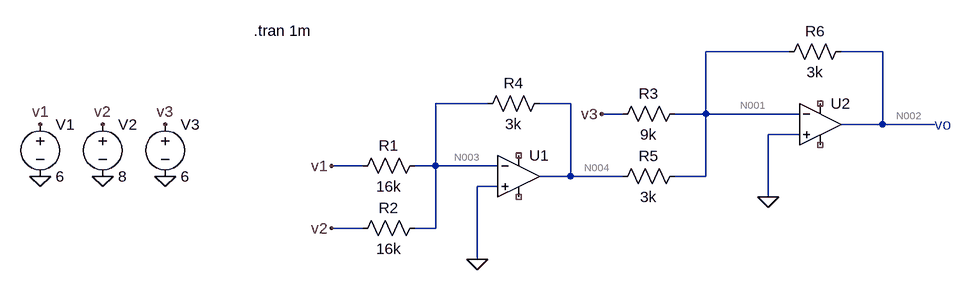
[diagram p0: schematic Q1 a1.asc]
Q1 a1.asc, the LTspice schematic file:
Version 4.1
SHEET 1 896 680
WIRE 640 -64 512 -64
WIRE 784 -64 720 -64
WIRE 176 16 96 16
WIRE 304 16 256 16
WIRE 384 32 352 32
WIRE 512 32 512 -64
WIRE 512 32 464 32
WIRE 656 32 512 32
WIRE 784 48 784 -64
WIRE 784 48 720 48
WIRE 864 48 784 48
WIRE 656 64 608 64
WIRE -16 112 -64 112
WIRE 96 112 96 16
WIRE 96 112 64 112
WIRE 192 112 96 112
WIRE 304 128 304 16
WIRE 304 128 256 128
WIRE 384 128 304 128
WIRE 512 128 512 32
WIRE 512 128 464 128
WIRE 192 144 160 144
WIRE 608 160 608 64
WIRE -16 208 -64 208
WIRE 96 208 96 112
WIRE 96 208 64 208
WIRE 160 256 160 144
FLAG -320 128 0
FLAG -416 128 0
FLAG -512 128 0
FLAG -512 48 v1
FLAG -64 112 v1
FLAG -416 48 v2
FLAG -64 208 v2
FLAG -320 48 v3
FLAG 352 32 v3
FLAG 160 256 0
FLAG 608 160 0
SYMBOL res 80 96 R90
WINDOW 0 0 56 VBottom 2
WINDOW 3 32 56 VTop 2
SYMATTR InstName R1
SYMATTR Value 16k
SYMBOL res 80 192 R90
WINDOW 0 0 56 VBottom 2
WINDOW 3 32 56 VTop 2
SYMATTR InstName R2
SYMATTR Value 16k
SYMBOL res 480 16 R90
WINDOW 0 0 56 VBottom 2
WINDOW 3 32 56 VTop 2
SYMATTR InstName R3
SYMATTR Value 9k
SYMBOL res 272 0 R90
WINDOW 0 0 56 VBottom 2
WINDOW 3 32 56 VTop 2
SYMATTR InstName R4
SYMATTR Value 3k
SYMBOL res 480 112 R90
WINDOW 0 0 56 VBottom 2
WINDOW 3 32 56 VTop 2
SYMATTR InstName R5
SYMATTR Value 3k
SYMBOL res 736 -80 R90
WINDOW 0 0 56 VBottom 2
WINDOW 3 32 56 VTop 2
SYMATTR InstName R6
SYMATTR Value 3k
SYMBOL OpAmps\\UniversalOpAmp1 224 128 R0
SYMATTR InstName U1
SYMATTR Value2 Avol=1000000G GBW=1000000G Vos=0
SYMBOL OpAmps\\UniversalOpAmp1 688 48 R0
SYMATTR InstName U2
SYMATTR Value2 Avol=1000000G GBW=1000000G Vos=0
SYMBOL voltage -512 32 R0
WINDOW 123 0 0 Left 0
WINDOW 39 0 0 Left 0
SYMATTR InstName V1
SYMATTR Value 6
SYMBOL voltage -416 32 R0
WINDOW 123 0 0 Left 0
WINDOW 39 0 0 Left 0
SYMATTR InstName V2
SYMATTR Value 8
SYMBOL voltage -320 32 R0
WINDOW 123 0 0 Left 0
WINDOW 39 0 0 Left 0
SYMATTR InstName V3
SYMATTR Value 6
TEXT 864 48 Left 2 ;vo
TEXT -184 -96 Left 2 !.tran 1m

The netlist it stands for:
* Q1 a1.asc
R1 N003 v1 16k
R2 N003 v2 16k
R3 N001 v3 9k
R4 N004 N003 3k
R5 N001 N004 3k
R6 N002 N001 3k
X§U1 0 N003 NC_01 NC_02 N004 level1 Avol=1000000G GBW=1000000G Vos=0 En=0 Enk=0 In=0 Ink=0 Rin=500Meg  ; pins In+ In- V+ V- OUT
X§U2 0 N001 NC_03 NC_04 N002 level1 Avol=1000000G GBW=1000000G Vos=0 En=0 Enk=0 In=0 Ink=0 Rin=500Meg  ; pins In+ In- V+ V- OUT
V1 v1 0 6
V2 v2 0 8
V3 v3 0 6
* vo
.tran 1m
.lib UniversalOpAmp1.lib
.backanno
.end

* Results of the author's LTspice run, read from the files saved beside the schematic
* Operating Point, zero values left out:
*   V(n002) = 625 mV
*   V(n004) = -2.625 V
*   V(v1) = 6 V
*   V(v2) = 8 V
*   V(v3) = 6 V
*   I(R1) = -375 µA
*   I(R2) = -500 µA
*   I(R3) = -666.7 µA
*   I(R4) = -875 µA
*   I(R5) = 875 µA
*   I(R6) = 208.3 µA
*   I(V1) = -375 µA
*   I(V2) = -500 µA
*   I(V3) = -666.7 µA
*   Ix(u1:5) = -250 mA
*   Ix(u2:5) = 250 mA
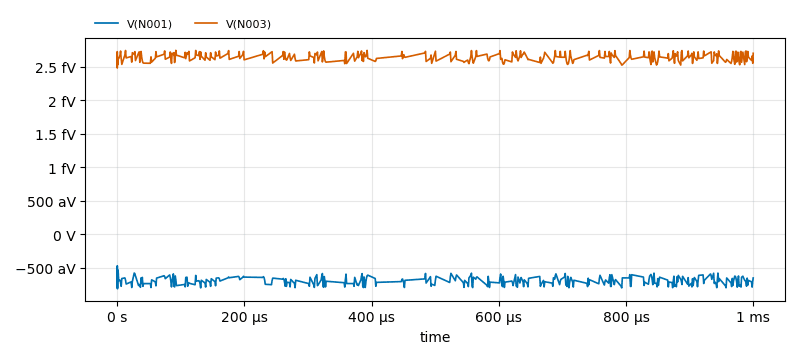
[diagram p1: Transient Analysis of Q1 a1.asc, plotted from the saved traces]
* Transient Analysis, 1 run:
*   V(N001): min -0.8153 fV, max -0.4724 fV, average -0.6928 fV, rms 0.6949 fV, last -0.654 fV
*   V(N003): min 2.482 fV, max 2.745 fV, average 2.637 fV, rms 2.638 fV, last 2.702 fV